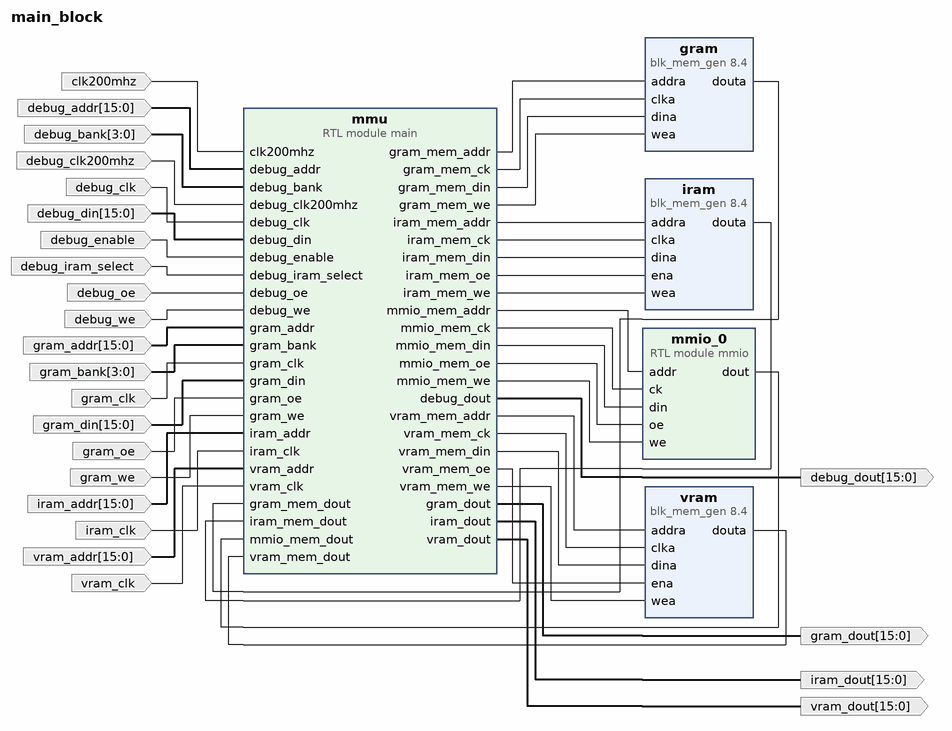
[diagram p0: block diagram of the top level]
# Vivado block design main_block, xc7a35ticsg324-1L, Vivado 2024.1
create_bd_design main_block

create_bd_port -dir I clk200mhz
create_bd_port -dir I -from 15 -to 0 iram_addr
create_bd_port -dir O -from 15 -to 0 iram_dout
create_bd_port -dir I iram_clk
create_bd_port -dir O -from 15 -to 0 gram_dout
create_bd_port -dir O -from 15 -to 0 vram_dout
create_bd_port -dir O -from 15 -to 0 debug_dout
create_bd_port -dir I -from 15 -to 0 gram_addr
create_bd_port -dir I -from 15 -to 0 gram_din
create_bd_port -dir I gram_we
create_bd_port -dir I gram_oe
create_bd_port -dir I -type clk gram_clk
set_property -dict {CONFIG.FREQ_HZ 100000000} [get_bd_ports gram_clk]
create_bd_port -dir I -from 3 -to 0 gram_bank
create_bd_port -dir I -type clk vram_clk
set_property -dict {CONFIG.FREQ_HZ 100000000} [get_bd_ports vram_clk]
create_bd_port -dir I -from 15 -to 0 vram_addr
create_bd_port -dir I -type clk debug_clk200mhz
set_property -dict {CONFIG.FREQ_HZ 200000000} [get_bd_ports debug_clk200mhz]
create_bd_port -dir I -type clk debug_clk
set_property -dict {CONFIG.FREQ_HZ 100000000} [get_bd_ports debug_clk]
create_bd_port -dir I debug_we
create_bd_port -dir I debug_oe
create_bd_port -dir I debug_enable
create_bd_port -dir I debug_iram_select
create_bd_port -dir I -from 15 -to 0 debug_addr
create_bd_port -dir I -from 15 -to 0 debug_din
create_bd_port -dir I -from 3 -to 0 debug_bank

create_bd_cell -type module -reference main mmu
create_bd_cell -type ip -vlnv xilinx.com:ip:blk_mem_gen:8.4 iram
set_property -dict [list \
  CONFIG.Algorithm Fixed_Primitives \
  CONFIG.Fill_Remaining_Memory_Locations false \
  CONFIG.Load_Init_File false \
  CONFIG.Register_PortA_Output_of_Memory_Core false \
  CONFIG.Register_PortA_Output_of_Memory_Primitives false \
  CONFIG.Write_Depth_A 16383 \
  CONFIG.Write_Width_A 16 \
  CONFIG.use_bram_block Stand_Alone \
] [get_bd_cells iram]
create_bd_cell -type ip -vlnv xilinx.com:ip:blk_mem_gen:8.4 gram
set_property -dict [list \
  CONFIG.Algorithm Minimum_Area \
  CONFIG.Enable_A Always_Enabled \
  CONFIG.Fill_Remaining_Memory_Locations true \
  CONFIG.Load_Init_File false \
  CONFIG.Register_PortA_Output_of_Memory_Primitives false \
  CONFIG.Remaining_Memory_Locations FFFF \
  CONFIG.Write_Depth_A 16383 \
  CONFIG.Write_Width_A 16 \
  CONFIG.use_bram_block Stand_Alone \
] [get_bd_cells gram]
create_bd_cell -type ip -vlnv xilinx.com:ip:blk_mem_gen:8.4 vram
set_property -dict [list \
  CONFIG.Algorithm Fixed_Primitives \
  CONFIG.Fill_Remaining_Memory_Locations false \
  CONFIG.Register_PortA_Output_of_Memory_Primitives false \
  CONFIG.Write_Depth_A 65535 \
  CONFIG.Write_Width_A 16 \
  CONFIG.use_bram_block Stand_Alone \
] [get_bd_cells vram]
create_bd_cell -type module -reference mmio mmio_0

# ---- connections ----

connect_bd_net -net blk_mem_gen_0_douta [get_bd_pins iram/douta] [get_bd_pins mmu/iram_mem_dout]
connect_bd_net [get_bd_ports clk200mhz] [get_bd_pins mmu/clk200mhz]
connect_bd_net [get_bd_ports debug_addr] [get_bd_pins mmu/debug_addr]
connect_bd_net [get_bd_ports debug_bank] [get_bd_pins mmu/debug_bank]
connect_bd_net [get_bd_ports debug_clk200mhz] [get_bd_pins mmu/debug_clk200mhz]
connect_bd_net [get_bd_ports debug_clk] [get_bd_pins mmu/debug_clk]
connect_bd_net [get_bd_ports debug_din] [get_bd_pins mmu/debug_din]
connect_bd_net [get_bd_ports debug_enable] [get_bd_pins mmu/debug_enable]
connect_bd_net [get_bd_ports debug_iram_select] [get_bd_pins mmu/debug_iram_select]
connect_bd_net [get_bd_ports debug_oe] [get_bd_pins mmu/debug_oe]
connect_bd_net [get_bd_ports debug_we] [get_bd_pins mmu/debug_we]
connect_bd_net [get_bd_ports gram_addr] [get_bd_pins mmu/gram_addr]
connect_bd_net [get_bd_ports gram_bank] [get_bd_pins mmu/gram_bank]
connect_bd_net [get_bd_ports gram_clk] [get_bd_pins mmu/gram_clk]
connect_bd_net [get_bd_ports gram_din] [get_bd_pins mmu/gram_din]
connect_bd_net [get_bd_pins gram/douta] [get_bd_pins mmu/gram_mem_dout]
connect_bd_net [get_bd_ports gram_oe] [get_bd_pins mmu/gram_oe]
connect_bd_net [get_bd_ports gram_we] [get_bd_pins mmu/gram_we]
connect_bd_net [get_bd_ports iram_addr] [get_bd_pins mmu/iram_addr]
connect_bd_net [get_bd_ports iram_clk] [get_bd_pins mmu/iram_clk]
connect_bd_net [get_bd_pins mmio_0/dout] [get_bd_pins mmu/mmio_mem_dout]
connect_bd_net [get_bd_pins mmu/debug_dout] [get_bd_ports debug_dout]
connect_bd_net [get_bd_pins mmu/gram_dout] [get_bd_ports gram_dout]
connect_bd_net [get_bd_pins mmu/gram_mem_addr] [get_bd_pins gram/addra]
connect_bd_net -net mmu_gram_mem_clk [get_bd_pins mmu/gram_mem_ck] [get_bd_pins gram/clka]
connect_bd_net [get_bd_pins mmu/gram_mem_din] [get_bd_pins gram/dina]
connect_bd_net [get_bd_pins mmu/gram_mem_we] [get_bd_pins gram/wea]
connect_bd_net [get_bd_pins mmu/iram_dout] [get_bd_ports iram_dout]
connect_bd_net [get_bd_pins mmu/iram_mem_addr] [get_bd_pins iram/addra]
connect_bd_net -net mmu_iram_mem_clk [get_bd_pins mmu/iram_mem_ck] [get_bd_pins iram/clka]
connect_bd_net [get_bd_pins mmu/iram_mem_din] [get_bd_pins iram/dina]
connect_bd_net [get_bd_pins mmu/iram_mem_oe] [get_bd_pins iram/ena]
connect_bd_net [get_bd_pins mmu/iram_mem_we] [get_bd_pins iram/wea]
connect_bd_net [get_bd_pins mmu/mmio_mem_addr] [get_bd_pins mmio_0/addr]
connect_bd_net [get_bd_pins mmu/mmio_mem_ck] [get_bd_pins mmio_0/ck]
connect_bd_net [get_bd_pins mmu/mmio_mem_din] [get_bd_pins mmio_0/din]
connect_bd_net [get_bd_pins mmu/mmio_mem_oe] [get_bd_pins mmio_0/oe]
connect_bd_net [get_bd_pins mmu/mmio_mem_we] [get_bd_pins mmio_0/we]
connect_bd_net [get_bd_pins mmu/vram_dout] [get_bd_ports vram_dout]
connect_bd_net [get_bd_pins mmu/vram_mem_addr] [get_bd_pins vram/addra]
connect_bd_net -net mmu_vram_mem_clk [get_bd_pins mmu/vram_mem_ck] [get_bd_pins vram/clka]
connect_bd_net [get_bd_pins mmu/vram_mem_din] [get_bd_pins vram/dina]
connect_bd_net [get_bd_pins mmu/vram_mem_oe] [get_bd_pins vram/ena]
connect_bd_net [get_bd_pins mmu/vram_mem_we] [get_bd_pins vram/wea]
connect_bd_net [get_bd_ports vram_addr] [get_bd_pins mmu/vram_addr]
connect_bd_net [get_bd_ports vram_clk] [get_bd_pins mmu/vram_clk]
connect_bd_net [get_bd_pins vram/douta] [get_bd_pins mmu/vram_mem_dout]

validate_bd_design
save_bd_design
